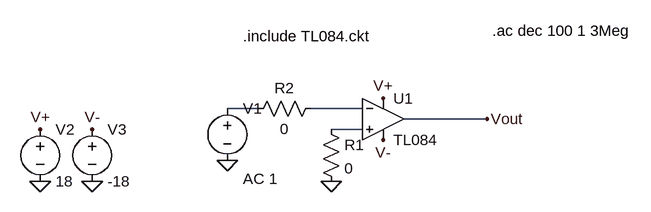
[diagram p0: schematic PruebaLazoAbiertoTL084.asc]
PruebaLazoAbiertoTL084.asc, the LTspice schematic file:
Version 4
SHEET 1 880 680
WIRE 32 144 -16 144
WIRE 192 144 112 144
WIRE 384 160 256 160
WIRE 192 176 144 176
FLAG 144 256 0
FLAG -224 256 0
FLAG -304 256 0
FLAG -16 224 0
FLAG -304 176 V+
FLAG 224 128 V+
FLAG -224 176 V-
FLAG 224 192 V-
FLAG 384 160 Vout
SYMBOL Opamps\\opamp2 224 96 R0
SYMATTR InstName U1
SYMATTR Value TL084
SYMBOL res 128 160 R0
SYMATTR InstName R1
SYMATTR Value 0
SYMBOL res 128 128 R90
WINDOW 0 0 56 VBottom 2
WINDOW 3 32 56 VTop 2
SYMATTR InstName R2
SYMATTR Value 0
SYMBOL voltage -16 128 R0
WINDOW 123 24 124 Left 2
WINDOW 39 0 0 Left 0
SYMATTR InstName V1
SYMATTR Value ""
SYMATTR Value2 AC 1
SYMBOL voltage -304 160 R0
WINDOW 123 0 0 Left 0
WINDOW 39 0 0 Left 0
SYMATTR InstName V2
SYMATTR Value 18
SYMBOL voltage -224 160 R0
WINDOW 123 0 0 Left 0
WINDOW 39 0 0 Left 0
SYMATTR InstName V3
SYMATTR Value -18
TEXT 8 32 Left 2 !.include TL084.ckt
TEXT 392 24 Left 2 !.ac dec 100 1 3Meg

The netlist it stands for:
* PruebaLazoAbiertoTL084.asc
XU1 N003 N002 V+ V- Vout TL084  ; pins In+ In- V+ V- OUT
R1 N003 0 0
R2 N002 N001 0
V1 N001 0 AC 1
V2 V+ 0 18
V3 V- 0 -18
.include TL084.ckt
.ac dec 100 1 3Meg
.backanno
.end